# EAGLE schematic tenacitas (EAGLE 7.2.0)
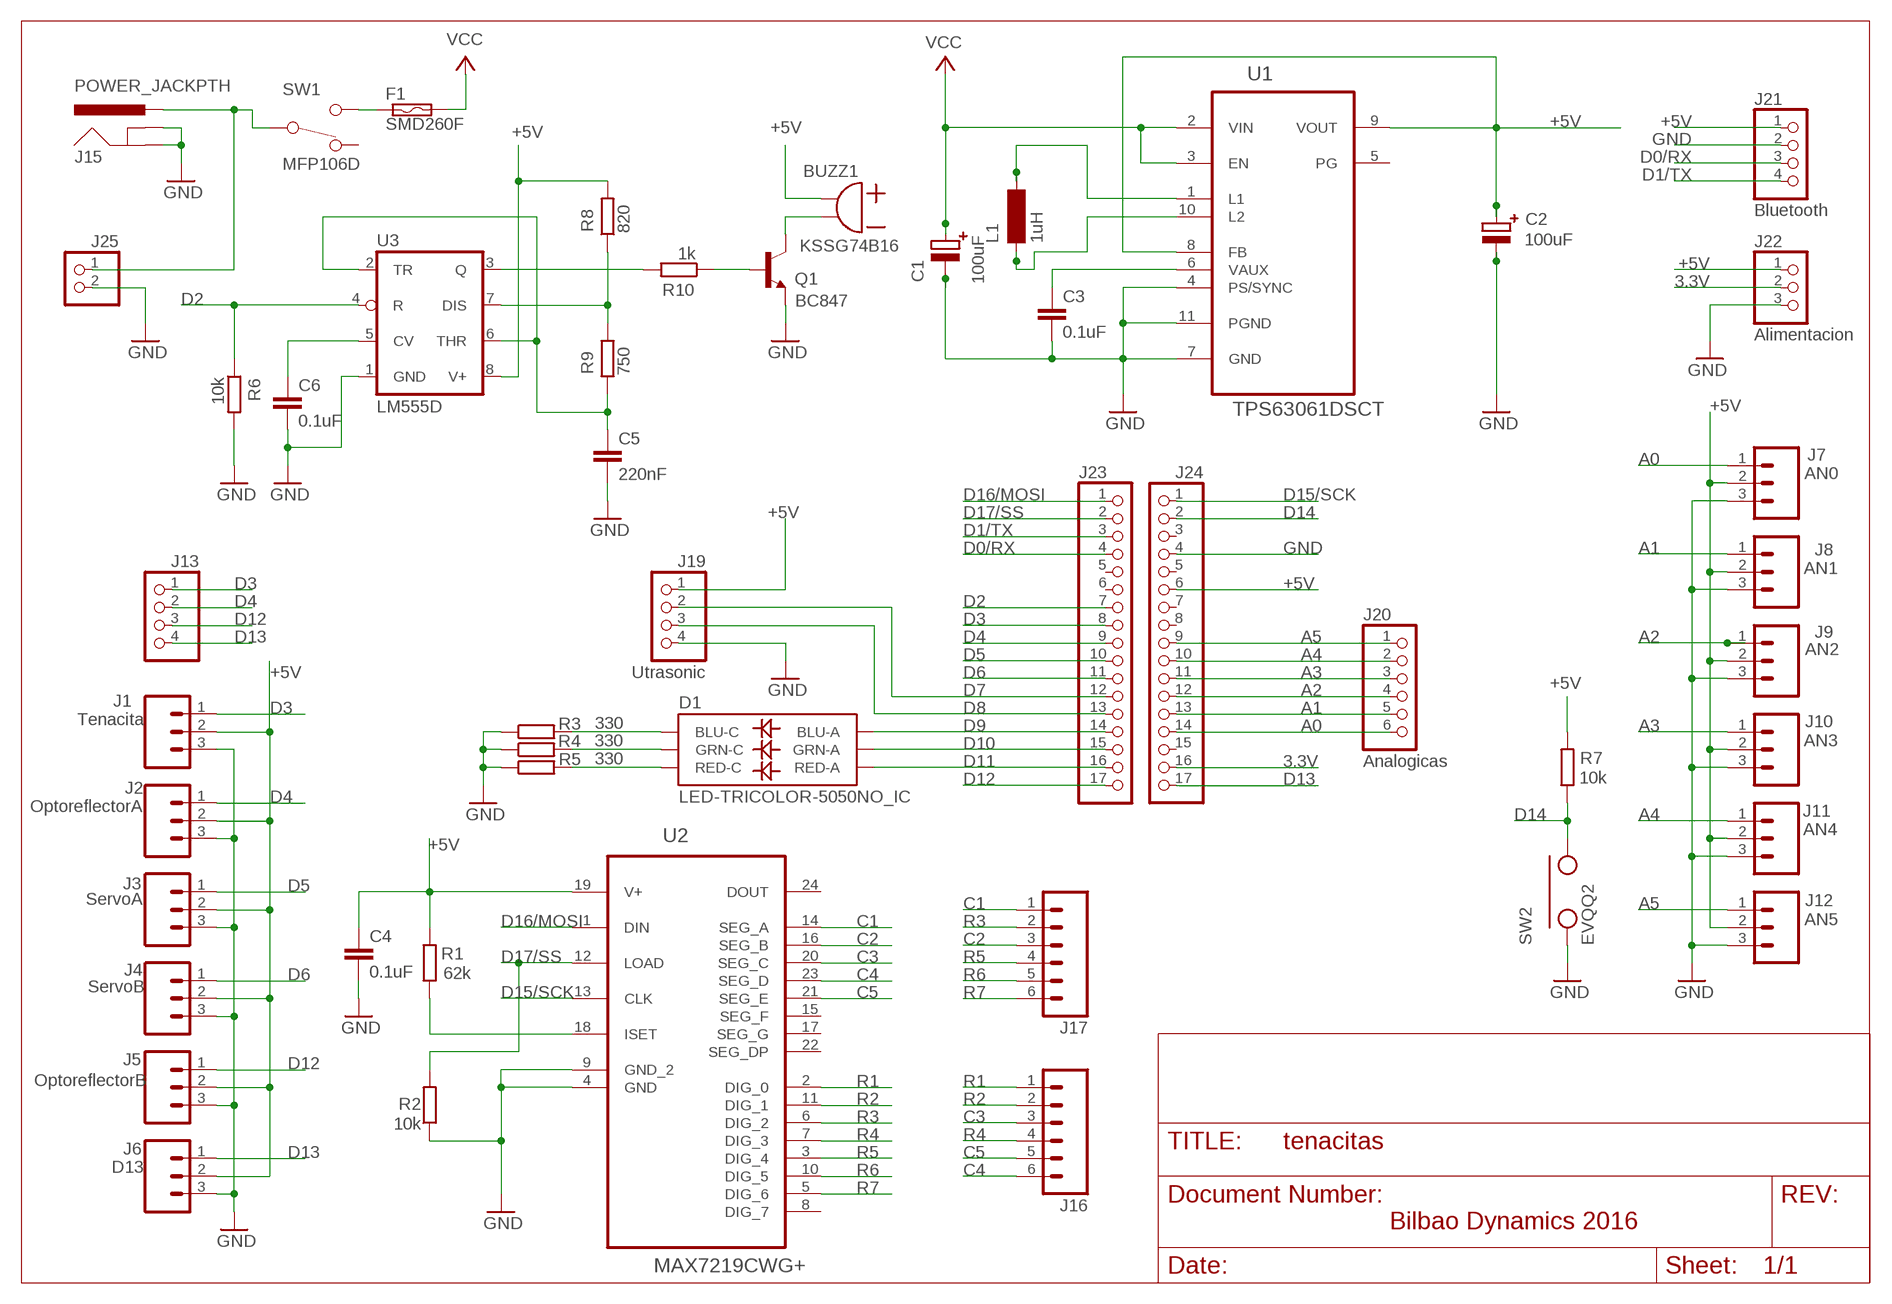
[diagram p0: schematic, sheet 1]

## Parts
BUZZ1  KSSG74B16  [KSSG74B16]
C1  100uF  EDK107M016A9G  [EDK107M016A9G]
C2  100uF  EDK107M016A9G  [EDK107M016A9G]
C3  0.1uF  C-EUC0805  [C0805]
C4  0.1uF  C-EUC0805  [C0805]
C5  220nF  C-EUC0805  [C0805]
C6  0.1uF  C-EUC0805  [C0805]
D1  LED-TRICOLOR-5050NO_IC  [LED-TRICOLOR-5050]
F1  SMD260F  [SMD050F]
J1  Tenacita  M03PTH  [1X03]
J2  OptoreflectorA  M03PTH  [1X03]
J3  ServoA  M03PTH  [1X03]
J4  ServoB  M03PTH  [1X03]
J5  OptoreflectorB  M03PTH  [1X03]
J6  D13  M03PTH  [1X03]
J7  AN0  M03PTH  [1X03]
J8  AN1  M03PTH  [1X03]
J9  AN2  M03PTH  [1X03]
J10  AN3  M03PTH  [1X03]
J11  AN4  M03PTH  [1X03]
J12  AN5  M03PTH  [1X03]
J13  PINHD-1X4  [1X04]
J15  POWER_JACKPTH  [POWER_JACK_PTH]
J16  M06SILK_FEMALE_PTH  [1X06]
J17  M06SILK_FEMALE_PTH  [1X06]
J19  Utrasonic  PINHD-1X4  [1X04]
J20  Analogicas  PINHD-1X6  [1X06]
J21  Bluetooth  PINHD-1X4  [1X04]
J22  Alimentacion  PINHD-1X3  [1X03]
J23  PINHD-1X17  [1X17]
J24  PINHD-1X17  [1X17]
J25  PINHD-1X2  [1X02]
L1  1uH  MCSDRH73B  [MCSDRH73B]
Q1  BC847  [SOT23]
R1  62k  R-EU_R0805  [R0805]
R2  10k  R-EU_R0805  [R0805]
R3  330  R-EU_R0805  [R0805]
R4  330  R-EU_R0805  [R0805]
R5  330  R-EU_R0805  [R0805]
R6  10k  R-EU_R0805  [R0805]
R7  10k  R-EU_R0805  [R0805]
R8  820  R-EU_R0805  [R0805]
R9  750  R-EU_R0805  [R0805]
R10  1k  R-EU_R0805  [R0805]
SW1  MFP106D  [MFP106D]
SW2  EVQQ2  JAEGGER_MKII_EVQQ2  [JAEGGER_MKII_EVQQ2]
U1  TPS63061DSCT  [SON50P300X300X80-11N]
U2  MAX7219CWG+  [SOIC127P1032X265-24N]
U3  LM555D  [SO08]

## Nets
3.3V: J22.2 J24.16
+5V: BUZZ1.P$2 BUZZ1.P$3 C2.1 C4.1 J1.2 J2.2 J3.2 J4.2 J5.2 J6.2 J7.2 J8.2 J9.2 J10.2 J11.2 J12.2 J19.1 J21.1 J22.1 J24.6 R1.2 R7.2 R8.2 U1.8(FB) U1.9(VOUT) U2.19(V+) U3.8(V+)
A0: J7.1 J20.6 J24.14
A1: J8.1 J20.5 J24.13
A2: J9.1 J20.4 J24.12
A3: J10.1 J20.3 J24.11
A4: J11.1 J20.2 J24.10
A5: J12.1 J20.1 J24.9
C1: J17.1 U2.14(SEG_A)
C2: J17.3 U2.16(SEG_B)
C3: J16.3 U2.20(SEG_C)
C4: J16.6 U2.23(SEG_D)
C5: J16.5 U2.21(SEG_E)
D0/RX: J21.3 J23.4
D1/TX: J21.4 J23.3
D2: J23.7 R6.1 U3.4(R)
D3: J1.1 J13.1 J23.8
D4: J2.1 J13.2 J23.9
D5: J3.1 J23.10
D6: J4.1 J23.11
D7: J19.2 J23.12
D8: J19.3 J23.13
D9: D1.3(BLU-A) J23.14
D10: D1.1(GRN-A) J23.15
D11: D1.2(RED-A) J23.16
D12: J5.1 J13.3 J23.17
D13: J6.1 J13.4 J24.17
D14: J24.2 R7.1 SW2.P$1 SW2.P$4
D15/SCK: J24.1 U2.13(CLK)
D16/MOSI: J23.1 U2.1(DIN)
D17/SS: J23.2 R2.2 U2.12(LOAD)
GND: C1.2 C2.2 C3.2 C4.2 C5.2 C6.2 J1.3 J2.3 J3.3 J4.3 J5.3 J6.3 J7.3 J8.3 J9.3 J10.3 J11.3 J12.3 J15.GND J15.GNDBREAK J19.4 J21.2 J22.3 J24.4 J25.2 Q1.2(E) R2.1 R3.1 R4.1 R5.1 R6.2 SW2.P$2 SW2.P$3 U1.4(PS/SYNC) U1.7(GND) U1.11(PGND) U2.4(GND) U2.9(GND_2) U3.1(GND)
N$1: R8.1 R9.2 U3.7(DIS)
N$2: R10.2 U3.3(Q)
N$3: D1.4(BLU-C) R3.2
N$4: D1.6(GRN-C) R4.2
N$5: C3.1 U1.6(VAUX)
N$6: D1.5(RED-C) R5.2
N$8: L1.2 U1.1(L1)
N$9: L1.1 U1.10(L2)
N$10: BUZZ1.P$1 BUZZ1.P$4 Q1.3(C)
N$11: C5.1 R9.1 U3.2(TR) U3.6(THR)
N$12: F1.1 SW1.2
N$13: C6.1 U3.5(CV)
N$15: Q1.1(B) R10.1
N$22: R1.1 U2.18(ISET)
N$23: J15.PWR J25.1 SW1.COM
R1: J16.1 U2.2(DIG_0)
R2: J16.2 U2.11(DIG_1)
R3: J17.2 U2.6(DIG_2)
R4: J16.4 U2.7(DIG_3)
R5: J17.4 U2.3(DIG_4)
R6: J17.5 U2.10(DIG_5)
R7: J17.6 U2.5(DIG_6)
VCC: C1.1 F1.2 U1.2(VIN) U1.3(EN)
Unconnected: J23.5 J23.6 J24.3 J24.5 J24.7 J24.8 J24.15 SW1.1 U1.5(PG) U2.8(DIG_7) U2.15(SEG_F) U2.17(SEG_G) U2.22(SEG_DP) U2.24(DOUT)

## Notes on the sheet
- Bilbao Dynamics 2016

## Library data of the parts
BUZZ1 = mk2:KSSG74B16
C1 C2 = Jaegger_MKII:EDK107M016A9G
C3-C6 = rcl:C-EU: CAPACITOR, European symbol
D1 = SparkFun-LED:LED-TRICOLOR-5050
F1 = switch-raychem:SMD*F: PolySwitch (TM) Resettable Device Source: Data sheet <http://www.farnell.com/datasheets/13482.pdf>
J1-J12 = SparkFun-Connectors:M03: Header 3 Standard 3-pin 0.1" header. Use with straight break away headers (SKU : PRT-00116), right angle break away headers (PRT-00553), swiss pins (PRT-00743), machine pins (PRT-00117), and female headers (PRT-00115). Molex polarized connector foot print use with SKU : PRT-08232 with associated crimp pins and housings.
J13 J19 J21 = pinhead:PINHD-1X4: PIN HEADER
J15 = SparkFun-Connectors:POWER_JACK: Power Jack This is the standard 5.5mm barrel jack for power. The PTH is the most common, proven, reliable, footprint. The Slot footprint only works if the mill layer is transmitted to the PCB fab house so be warned. Mating wall wart : TOL-00298 (and others); PROD_ID: CONN-08197
J16 J17 = SparkFun-Connectors:M06: Header 6 Standard 6-pin 0.1" header. Use with straight break away headers (SKU : PRT-00116), right angle break away headers (PRT-00553), swiss pins (PRT-00743), machine pins (PRT-00117), and female headers (PRT-00115). Molex polarized connector foot print use with SKU : PRT-08094 with associated crimp pins and housings. NOTES ON THE VARIANTS LOCK and LOCK_LONGPADS... This footprint was designed to help hold the alignment of a through-hole component (i.e. 6-pin header) while soldering it into place. You may notice that each hole has been shifted either up or down by 0.005 of an inch from it's more standard position (which is a perfectly straight line). This slight alteration caused the pins (the squares in the middle) to touch the edges of the holes. Because they are alternating, it causes a "brace" to hold the component in place. 0.005 has proven to be the perfect amount of "off-center" position when using our standard breakaway headers. Although looks a little odd when you look at the bare footprint, once you have a header in there, the alteration is very hard to notice. Also,if you push a header all the way into place, it is covered up entirely on the bottom side. This idea of altering the position of holes to aid alignment will be further integrated into the Sparkfun Library for other footprints. It can help hold any component with 3 or more connection pins.; PROD_ID: CONN-08437
J20 = pinhead:PINHD-1X6: PIN HEADER
J22 = pinhead:PINHD-1X3: PIN HEADER
J23 J24 = pinhead:PINHD-1X17: PIN HEADER
J25 = pinhead:PINHD-1X2: PIN HEADER
L1 = Jaegger_MKII:MCSDRH73B
Q1 = transistor:BC847: NPN TRANSISTOR
R1-R10 = rcl:R-EU_: RESISTOR, European symbol
SW1 = mk2:MFP106D
SW2 = mk2:JAEGGER_MKII_EVQQ2
U1 = Jaegger_MKII:TPS63061DSCT: VOLTAGE BUCK-BOOST CONVERTER,SON- 10; MPN: TPS63061DSCT; OC_FARNELL: 2078527; OC_NEWARK: 82T9734; PACKAGE: SON- 10; SUPPLIER: TEXAS INSTRUMENTS
U2 = maxim7219:MAX7219CWG+: Serially Interfaced, 8-Digit LED Display Drivers; MPN: MAX7219CWG+; OC_FARNELL: 9726357; OC_NEWARK: 67K6644; PACKAGE: SOIC-24; SUPPLIER: Maxim
U3 = linear:*555: TIMER